# EAGLE design untitled (EAGLE 8.0.1)
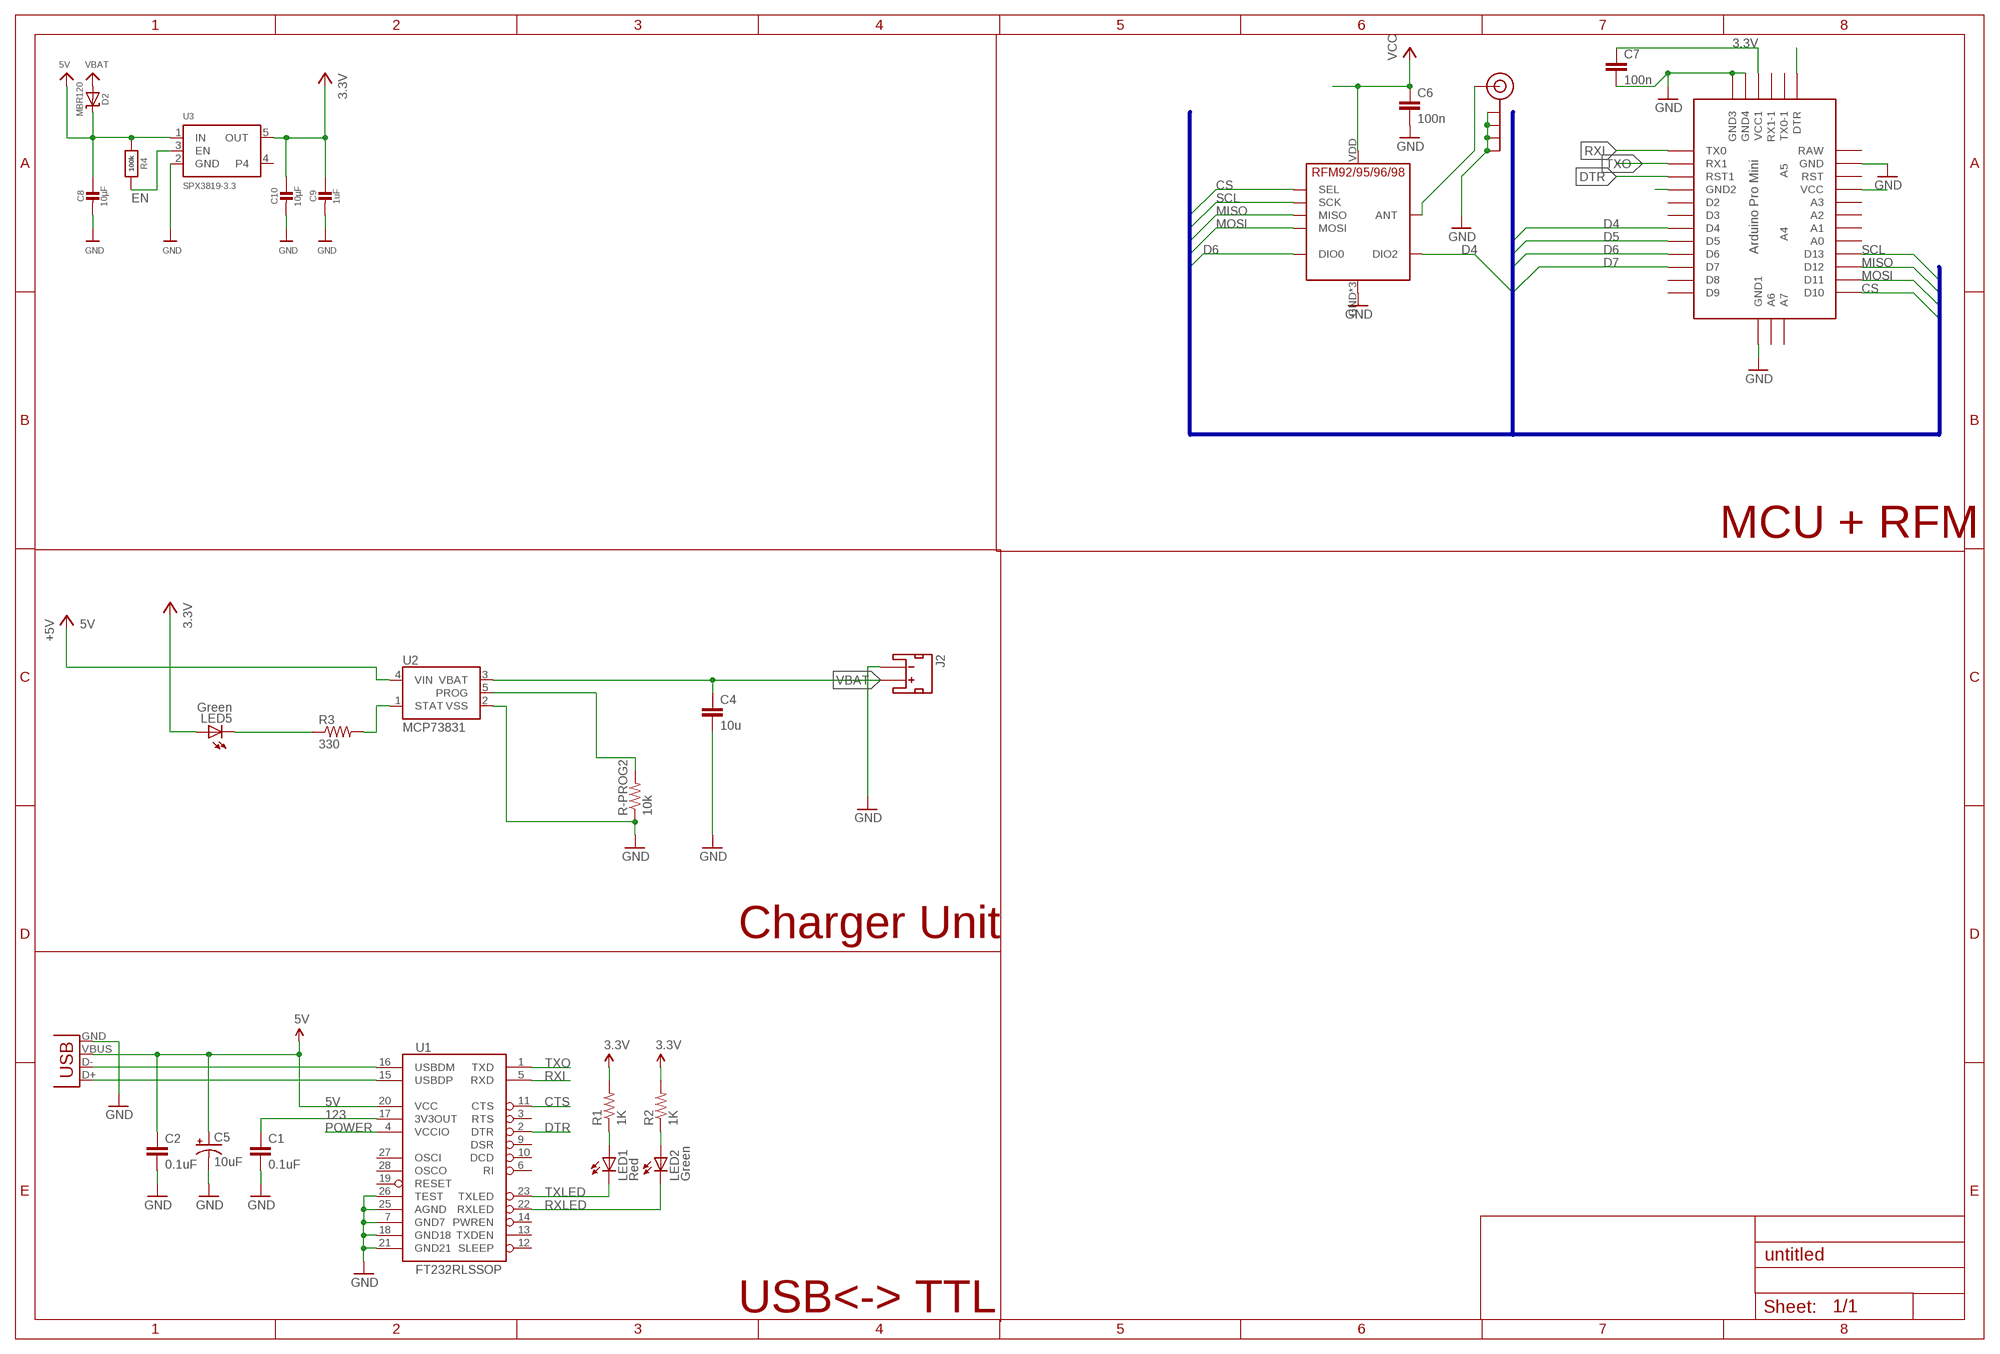
[diagram p0: schematic, sheet 1]

## Parts
C1  0.1uF  CAP0402-CAP  [0402-CAP]
C2  0.1uF  CAP0402-CAP  [0402-CAP]
C4  10u  4.7UF-6.3V-10%(0603)0603  [0603-CAP]
C5  10uF  CAP_POL1206  [EIA3216]
C6  100n  C-EUC0805  [C0805]
C7  100n  C-EUC0805  [C0805]
C8  10µF  CAP_CERAMIC0805-NOOUTLINE  [0805-NO]
C9  1uF  CAP_CERAMIC0603_NO  [0603-NO]
C10  10µF  CAP_CERAMIC0805-NOOUTLINE  [0805-NO]
D2  MBR120  DIODE-SCHOTTKYSOD-123  [SOD-123]
J2  JST_2MM_MALE  [JST-2-SMD]
J$2  ANTENNATINY  [SMA_UFL_PAD_TINY]
LED1  Red  LED0603  [LED-0603]
LED2  Green  LED0603  [LED-0603]
LED5  Green  LED0603  [LED-0603]
R1  1K  RESISTOR0402-RES  [0402-RES]
R2  1K  RESISTOR0402-RES  [0402-RES]
R3  330  330OHM1/10W1%(0603)  [0603-RES]
R4  100k  RESISTOR_0603_NOOUT  [0603-NO]
R-PROG2  10k  10KOHM1/10W1%(0603)0603  [0603-RES]
U1  FT232RLSSOP  [SSOP28DB]
U2  MCP73831  [SOT23-5]
U3  SPX3819-3.3  VREG_SOT23-5  [SOT23-5]
U$1  ABK-PRO-MINI  [ABK-PRO-MINI]
U$6  RFM95  [RFM95]
X2  USB-SMD-NS  [USB-MINIB-NOSTOP]

## Nets
3.3V [power]: C6.1 C7.1 C9.1 C10.1 R1.2 R2.2 U3.5(OUT) U$1.VCC U$1.VCC1 U$6.VDD(VCC) ; supply symbol labelled VCC
5V: C2.1 C5.A(+) C8.1 D2.C R4.1 U1.20(VCC) U2.4(VIN) U3.1(IN) X2.VBUS ; supply symbol labelled +5V
123 [power]: C1.1 U1.17(3V3OUT)
+3V3: LED5.A ; supply symbol labelled 3.3V
CS: U$1.D10 U$6.NSS(SEL)
CTS: U1.11(CTS)
D4: U$1.D4 U$6.DIO2
D5: U$1.D5
D6: U$1.D6 U$6.DIO0
D7: U$1.D7
DTR: U1.2(DTR) U$1.RST1
EN: R4.2 U3.3(EN)
GND: C1.2 C2.2 C4.2 C5.C(-) C6.2 C7.2 C8.2 C9.2 C10.2 J2.1(-) J$2.GND1(GND) J$2.GND2(GND) J$2.GND3(GND) J$2.GND4(GND) R-PROG2.1 U1.7(GND7) U1.18(GND18) U1.21(GND21) U1.25(AGND) U1.26(TEST) U2.2(VSS) U3.2(GND) U$1.GND U$1.GND1(GND2) U$1.GND2(GND3) U$1.GND3(GND4) U$1.GND4(GND1) U$6.GND U$6.GND1(GND) U$6.GND2(GND) X2.GND
LOL: R-PROG2.2 U2.5(PROG)
MISO: U$1.D12 U$6.MISO
MOSI: U$1.D11 U$6.MOSI
N$1: LED1.A R1.1
N$2: LED2.A R2.1
N$4: J$2.ANT1(SIGNAL) J$2.ANT2(SIGNAL) J$2.ANT3(SIGNAL) U$6.ANT
N$5: LED5.C R3.1
N$6: R3.2 U2.1(STAT)
N$9: U$1.DTR
POWER: U1.4(VCCIO)
RXI: U1.5(RXD) U$1.TX0
RXLED: LED2.C U1.22(RXLED)
SCL: U$1.D13 U$6.SCK
TXLED: LED1.C U1.23(TXLED)
TXO: U1.1(TXD) U$1.RX1
USB_D+: U1.15(USBDP) X2.D+
USB_D-: U1.16(USBDM) X2.D-
VBAT: C4.1 D2.A J2.2(+) U2.3(VBAT)
Unconnected: J2.NC1(PAD1) J2.NC2(PAD2) U1.3(RTS) U1.6(RI) U1.9(DSR) U1.10(DCD) U1.12(SLEEP) U1.13(TXDEN) U1.14(PWREN) U1.19(RESET) U1.27(OSCI) U1.28(OSCO) U3.4 U$1.A0 U$1.A1 U$1.A2 U$1.A3 U$1.A4 U$1.A5 U$1.A6 U$1.A7 U$1.D2 U$1.D3 U$1.D8 U$1.D9 U$1.RAW U$1.RST U$1.RX1-1 U$1.TX0-1

## Buses
SCL,MISO,MOSI,CS,D4,D5,D6,D7

## Notes on the sheet
- MCU + RFM
- Charger Unit
- USB<-> TTL

## Library data of the parts
C1 C2 = SparkFun:CAP: Capacitor Standard 0603 ceramic capacitor, and 0.1" leaded capacitor.
C4 = SparkFun-Capacitors:4.7UF-6.3V-10%(0603): CAP-08280; PROD_ID: CAP-08280; VALUE: 4.7uF
C5 = SparkFun:CAP_POL: Capacitor Polarized These are standard SMD and PTH capacitors. Normally 10uF, 47uF, and 100uF in electrolytic and tantalum varieties. Always verify the external diameter of the through hole cap, it varies with capacity, voltage, and manufacturer. The EIA devices should be standard.
C6 C7 = rcl:C-EU: CAPACITOR, European symbol
C8-C10 = microbuilder:CAP_CERAMIC: Ceramic Capacitors For new designs, use the packages preceded by an '_' character since they are more reliable: The following footprints should be used on most boards: _0402 - Standard footprint for regular board layouts _0603 - Standard footprint for regular board layouts _0805 - Standard footprint for regular board layouts _1206 - Standard footprint for regular board layouts For extremely tight-pitch boards where space is at a premium, the following 'micro-pitch' footprints can be used (smaller pads, no silkscreen outline, etc.): _0402MP - Micro-pitch footprint for very dense/compact boards _0603MP - Micro-pitch footprint for very dense/compact boards _0805MP - Micro-pitch footprint for very dense/compact boards _1206MP - Micro-pitch footprint for very dense/compact boards
D2 = microbuilder:DIODE-SCHOTTKY
J2 = SparkFun-Connectors:JST_2MM_MALE: Mates to single-cell LiPo batteries. CONN-08352; PROD_ID: CONN-08352
J$2 = _c2h:ANTENNA: SMA Antenna Connector End launch SMA connector. The paste layer has been removed so that the connector can be hand soldered onto the board after reflow.
LED1 LED2 LED5 = SparkFun:LED: LEDs Standard schematic elements and footprints for 5mm, 3mm, 1206, and 0603 sized LEDs. 5mm - Spark Fun Electronics SKU : COM-00529 (and others)
R1 R2 = SparkFun:RESISTOR: Resistor Basic schematic elements and footprints for 0603, 1206, and PTH resistors.
R3 = SparkFun-Resistors:330OHM1/10W1%(0603): RES-00818; PROD_ID: RES-00818
R4 = microbuilder:RESISTOR: Resistors For new designs, use the packages preceded by an '_' character since they are more reliable: The following footprints should be used on most boards: _0402 - Standard footprint for regular board layouts _0603 - Standard footprint for regular board layouts _0805 - Standard footprint for regular board layouts _1206 - Standard footprint for regular board layouts For extremely tight-pitch boards where space is at a premium, the following 'micro-pitch' footprints can be used (smaller pads, no silkscreen outline, etc.): _0402MP - Micro-pitch footprint for very dense/compact boards _0603MP - Micro-pitch footprint for very dense/compact boards _0805MP - Micro-pitch footprint for very dense/compact boards _1206MP - Micro-pitch footprint for very dense/compact boards
R-PROG2 = SparkFun-Resistors:10KOHM1/10W1%(0603): RES-00824; PROD_ID: RES-00824; VALUE: 10K
U1 = SparkFun:FT232RL: USB UART FT232RL 4th Generation USB UART (USB <-> Serial) Controller. Spark Fun Electronics SKU : COM-00650
U2 = SparkFun-PowerIC:MCP73831: Miniature single cell, fully integrated Li-Ion, Li-polymer charge management controller http://ww1.microchip.com/downloads/en/DeviceDoc/21984a.pdf IC-09995; PROD_ID: IC-09995
U3 = microbuilder:VREG_SOT23-5: SOT23-5 Fixed Voltage Regulators Part Current Out V Out V In V Dropout θJA (°C/W) TJ (°C) Digikey Part No. ADP121 150mA 3.3V 3.4-5.5V 0.09V @ 150mA -- -- ADP121-AUJZ33R7CT-ND ADP121 150mA 3.0V 3.1-5.5V 0.09V @ 150mA -- -- ADP121-AUJZ30R7CT-ND ADP122 300mA 3.3V 3.4-5.5V 0.085V @ 300mA -- -- ADP122AUJZ-3.3-R7CT-ND ADP1712 300mA 3.3V 3.5-5.5V 0.17V @ 300mA -- -- ADP1712AUJZ-3.3-R7TR-ND AP7311 (Low Cost) 150mA 3.3V 3.5-6V 0.15V @ 150mA -- -- AP7311-33WG-7DICT-ND LD39015M18R 150mA 1.8V 1.9V-5.5V 0.08V @ 100mA -- -- 497-6977-1-ND LP2985A-33DBVR 150mA 3.3V 3.3-16V 0.28V @ 150mA 206 150 296-18479-1-ND MCP1824T-3302E/OT 300mA 3.3V 3.5V-6V 0.2V @ 300mA -- -- MCP1824T-3302E/OTCT-ND MIC5205-2.5YM5 TR 150mA 2.5V 2.7-16V 0.165V @ 150mA -- -- 576-1257-2-ND MIC5205-3.0YM5 TR 150mA 3.0V 3.2V-16V 0.165V @ 150mA -- -- 576-1258-2-ND MIC5205-3.3YM5 TR 150mA 3.3V 3.5V-16V 0.165V @ 150mA -- -- 576-1259-2-ND TPS780330220 150mA 3.3V+2.2V 3.6-5.5V 250mV Max -- -- 296-23332-1-ND TDA3663/N1,135 100mA 3.3V 3.5-45V 0.18V @ 50mA -- -- 568-5343-1-ND Max operating temp can be calculated using θJA, TJ (max junction temperature), and power in watts. Set the "Maximum Ambient Temperature" until it reaches TJ ("Max Junction Temperature"), which is the absolute limit for safe use of the regulator: Heat Sink Temperature Calculator <http://www.daycounter.com/Calculators/Heat-Sink-Temperature-Calculator.phtml> For example, With 12V source into a 3.3V LP2985 and a 30mA load, we are dissipating (12V-3.3V) * 0.03A = 0.261W. With a θJA of 206 °C/W, a TJ of 150°C, and 261mW we can safely use the chip without a heat sink up to 75°C (=147.1°C Junction Temperature).
U$1 = Arduino-clone:ABK-PRO-MINI: ABK Pro-Mini Arduino Clone
U$6 = _c2h:RFM95
X2 = SparkFun:USB: USB Connectors USB-B-PTH is fully proven SKU : PRT-00139 USB-miniB is fully proven SKU : PRT-00587 USB-A-PCB is untested. USB-A-H is throughly reviewed, but untested. Spark Fun Electronics SKU : PRT-00437 USB-B-SMT is throughly reviewed, but untested. Needs silkscreen touching up. USB-A-S has not been used/tested USB-MB-H has not been used/tested

## Net classes
0 default: width 0.254 mm, drill 0.6 mm, clearance 0.254 mm
1 power: width 0.406 mm, drill 0.6 mm, clearance 0.254 mm

## Board
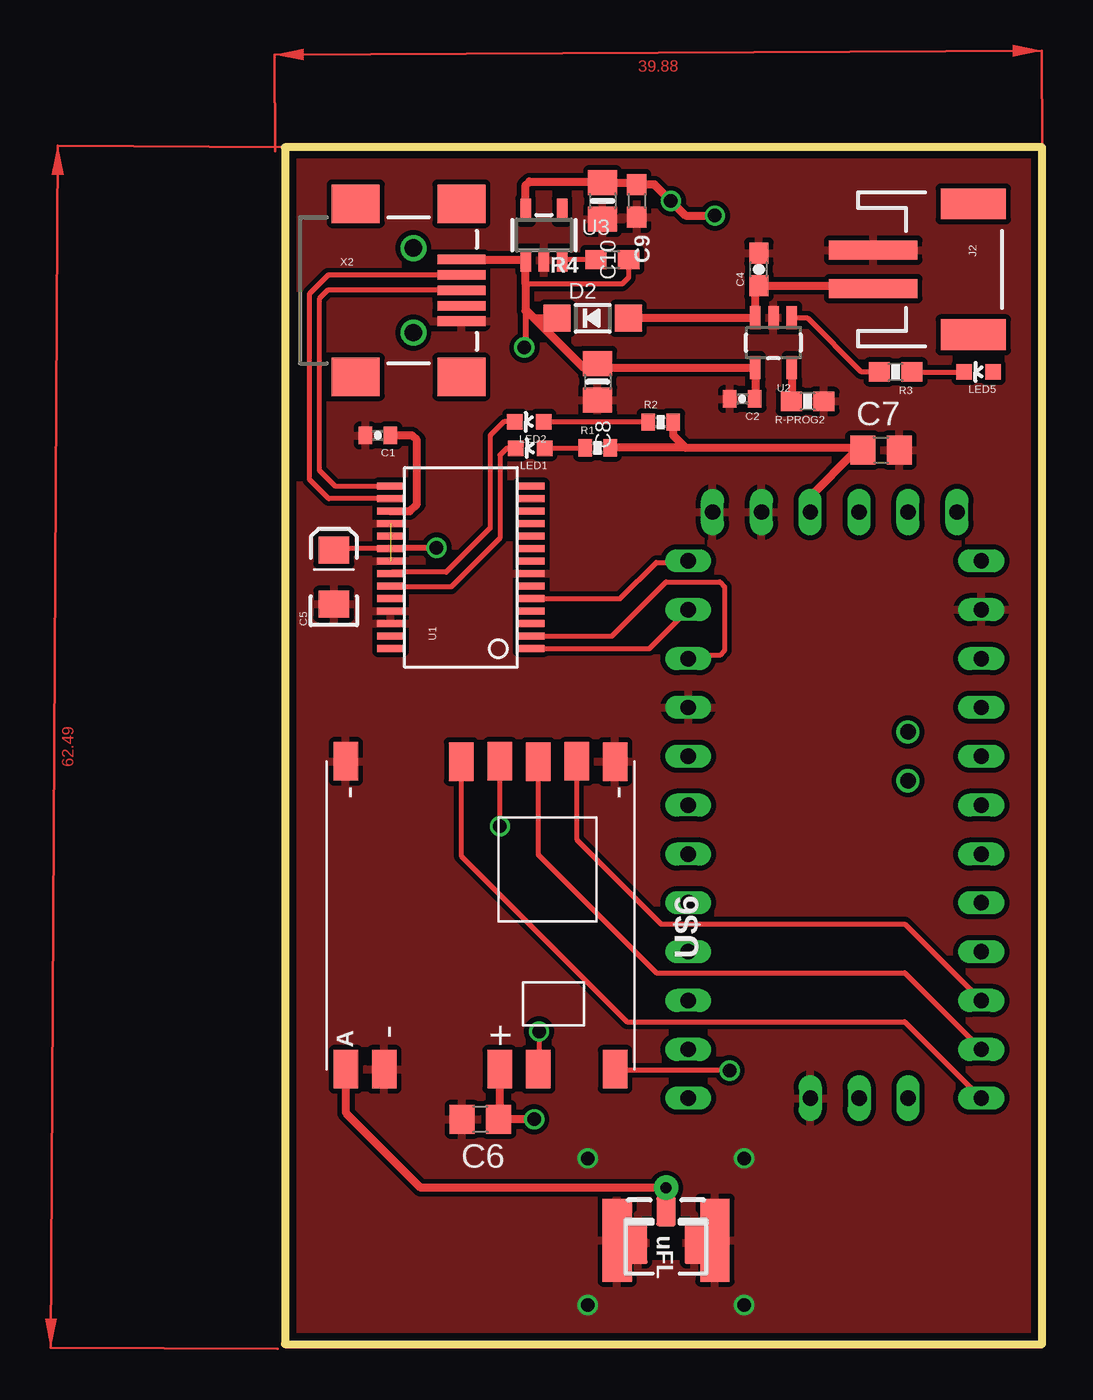
[diagram p1: board, top side]
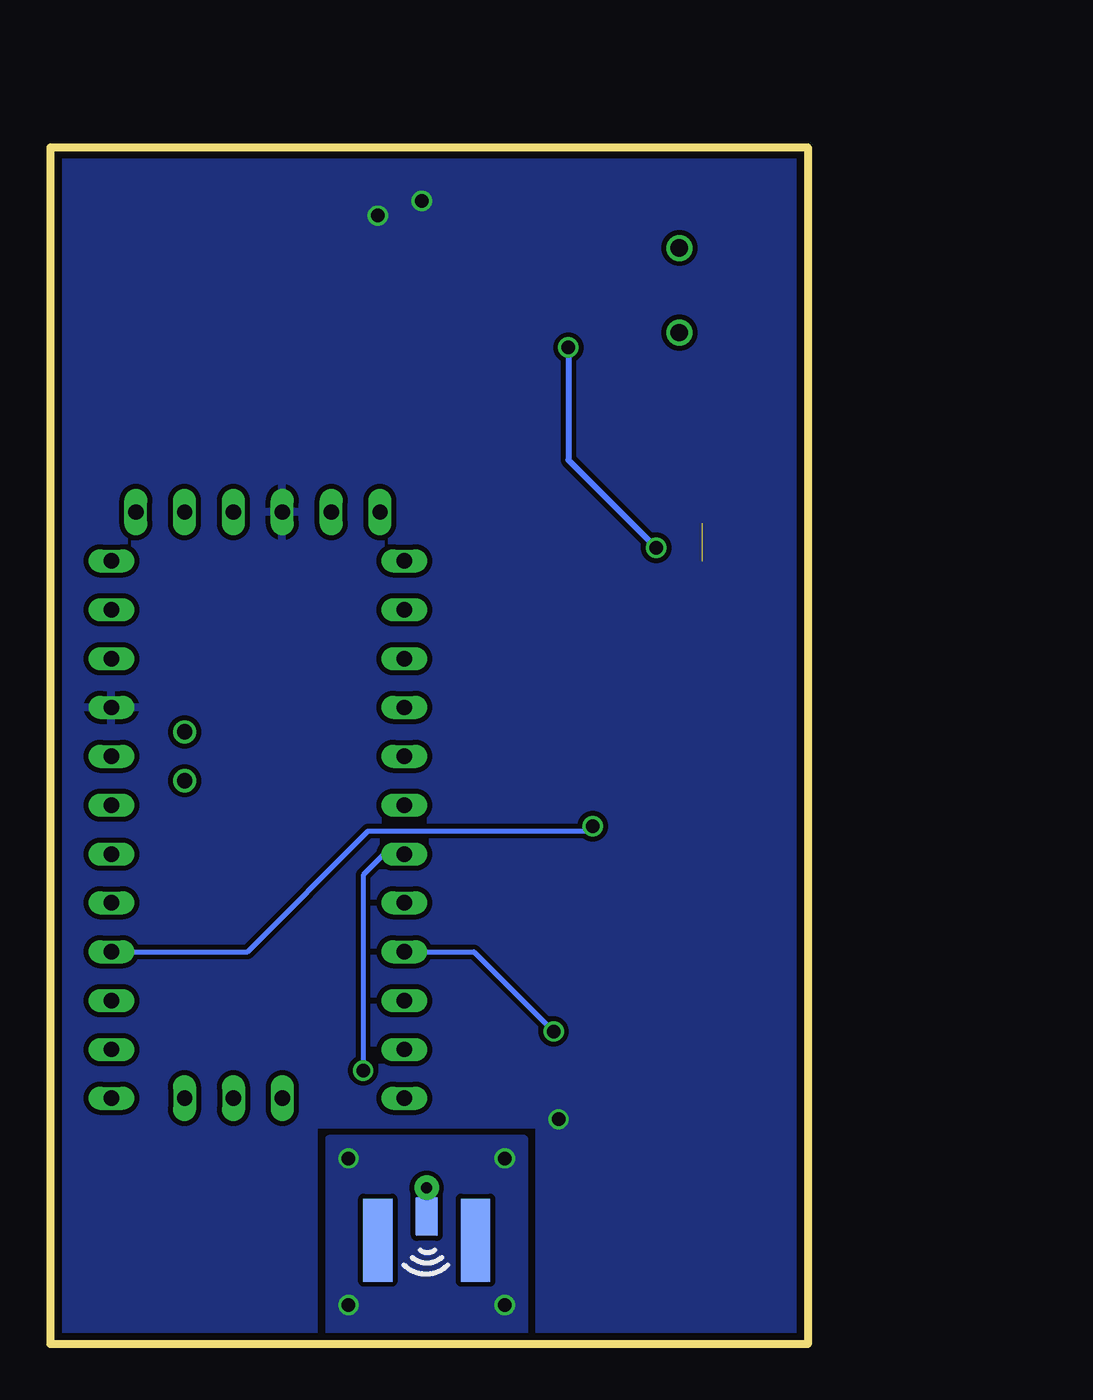
[diagram p2: board, bottom side, seen from below]

Size 39.37 x 62.23 mm. Coordinates in mm from the lower left corner, seen from the top.
Outline: 39.37,62.23 0,62.23 0,0 39.37,0 39.37,62.23
Copper layers (1*16): Top 0.0356mm / dielectric 1.5011mm / Bottom 0.0356mm
Design rules "PCBs_io": minimum track width 6mil, minimum drill 13mil, track to track 6mil, track to pad 6mil, pad to pad 6mil, via to via 6mil, smd to smd 6mil, copper to edge 15mil, drill to drill 6mil, minimum pad ring 7mil, minimum via ring 7mil, stop-mask expansion 3mil, vias tented up to drill 0mil, thermal gap 10mil

### Footprints (pad centres in the part's own frame; a part is rotated, then mirrored left to right if it is on the bottom)
0402-CAP = smd 0.7 x 0.9: 1 -0.65,0; 2 0.65,0
0603-CAP = smd 1.1 x 1: 1 -0.85,0; 2 0.85,0
EIA3216 = smd 1.4 x 1.6: A 1.4,0; C -1.4,0
C0805 = smd 1.3 x 1.5: 1 -0.95,0; 2 0.95,0
0805-NO = smd 1.3 x 1.5: 1 -0.95,0; 2 0.95,0
0603-NO = smd 1.1 x 1: 1 -0.85,0; 2 0.85,0
SOD-123 = smd 1.4 x 1.4: A 1.85,0; C -1.85,0
JST-2-SMD = smd 1 x 4.6: 1 -1,-3.7; 2 1,-3.7 | smd 1.6 x 3.4: NC1 -3.4,1.5; NC2 3.4,1.5
SMA_UFL_PAD_TINY = smd 1.524 x 1.016: ANT1 -3.843,0 | drill 0.559 pad 1.27: ANT2 -5.08,0 | smd 2.032 x 1.143 bottom: ANT3 -3.589,0 | smd 2.2 x 1.016: GND1 -2.223,1.47; GND2 -2.223,-1.47 | smd 4.318 x 1.524: GND3 -2.349,-2.54; GND4 -2.349,2.54 | smd 4.318 x 1.524 bottom: GND5 -2.349,2.54; GND6 -2.349,-2.54
LED-0603 = smd 0.8 x 0.8: A 0,-0.75; C 0,0.75
0402-RES = smd 0.7 x 0.9: 1 -0.65,0; 2 0.65,0
0603-RES = smd 1.1 x 1: 1 -0.85,0; 2 0.85,0
SSOP28DB = smd 0.348 x 1.397: 1 -4.225,-3.656; 2 -3.575,-3.656; 3 -2.925,-3.656; 4 -2.275,-3.656; 5 -1.625,-3.656; 6 -0.975,-3.656; 7 -0.325,-3.656; 8 0.325,-3.656; 9 0.975,-3.656; 10 1.625,-3.656; 11 2.275,-3.656; 12 2.925,-3.656; 13 3.575,-3.656; 14 4.225,-3.656; 15 4.225,3.656; 16 3.575,3.656; 17 2.925,3.656; 18 2.275,3.656; 19 1.625,3.656; 20 0.975,3.656; 21 0.325,3.656; 22 -0.325,3.656; 23 -0.975,3.656; 24 -1.625,3.656; 25 -2.275,3.656; 26 -2.925,3.656; 27 -3.575,3.656; 28 -4.225,3.656
SOT23-5 = smd 0.55 x 1.2: 1 -0.95,-1.3; 2 0,-1.3; 3 0.95,-1.3; 4 0.95,1.3; 5 -0.95,1.3
ABK-PRO-MINI = drill 0.8 long: A0 10.16,-3.81; A1 10.16,-6.35; A2 10.16,-8.89; A3 10.16,-11.43; A6 3.81,-21.59; A7 6.35,-21.59; D2 -5.08,-3.81; D3 -5.08,-6.35; D4 -5.08,-8.89; D5 -5.08,-11.43; D6 -5.08,-13.97; D7 -5.08,-16.51; D8 -5.08,-19.05; D9 -5.08,-21.59; D10 10.16,-21.59; D11 10.16,-19.05; D12 10.16,-16.51; D13 10.16,-13.97; DTR 8.89,8.89; GND 10.16,3.81; GND1 -5.08,-1.27; GND2 -3.81,8.89; GND3 -1.27,8.89; GND4 1.27,-21.59; RAW 10.16,6.35; RST 10.16,1.27; RST1 -5.08,1.27; RX1 -5.08,3.81; RX1-1 3.81,8.89; TX0 -5.08,6.35; TX0-1 6.35,8.89; VCC 10.16,-1.27; VCC1 1.27,8.89 | drill 0.8: A4 6.35,-5.08; A5 6.35,-2.54
RFM95 = smd 2 x 1.27: ANT 5.777,-7; DIO0 5.777,3; DIO2 5.779,7; GND 5.777,-5; GND1 -10.223,7; GND2 -10.23,-7; MISO -10.23,5; MOSI -10.225,3; NSS -10.223,-1; SCK -10.23,1.012; VDD 5.777,1
USB-MINIB-NOSTOP = smd 2.5 x 0.5: D+ 2.5,0; D- 2.5,0.8; GND 2.5,-1.6; ID 2.5,-0.8; VBUS 2.5,1.6 | smd 2.5 x 2: G1 -3,-4.5; G2 -3,4.5; G3 2.5,4.5; G4 2.5,-4.5 | drill 0.9 pad 0.8: H1 0,2.2 | drill 0.9 pad 0.787: H2 0,-2.2

### Placement (x,y rotation side)
C1  4.83,47.24 180 top
C2  23.78,49.14 180 top
C4  24.64,55.88 90 top
C5  2.54,39.88 90 top
C6  10.16,11.68 180 top
C7  30.99,46.48 0 top
C8  16.26,50.04 270 top
C9  18.29,59.44 270 top
C10  16.51,59.44 270 top
D2  16,53.34 0 top
J2  34.29,55.88 270 top
J$2  19.81,3.05 270 top
LED1  12.75,46.58 90 top
LED2  12.7,47.96 90 top
LED5  36.07,50.55 90 top
R1  16.25,46.6 0 top
R2  19.54,47.94 0 top
R3  31.75,50.55 180 top
R4  17.02,56.39 180 top
R-PROG2  27.18,49.02 180 top
U1  9.14,40.39 90 top
U2  25.4,52.07 180 top
U3  13.46,57.66 0 top
U$1  26.05,34.37 0 top
U$6  10.16,20.07 270 top
X2  6.67,54.79 0 top

### Tracks (layer width: path | path; a pad name or v marks a point on that pad's centre or on a via)
3.3V  (via drill 0.7)
  Top 0.254: R2.2 20.19,47.5
  Top 0.406: U3.5 12.51,60.26 12.7,60.45 16.44,60.45 C10.1 18.19,60.39 C9.1 19.22,60.29 v20.07,59.44 20.83,58.67 v22.35,58.67 | U$6.VDD 11.16,11.77 C6.1 v12.95,11.68 | 20.83,46.6 R1.2 | 20.83,46.6 29.92,46.6 C7.1 29.72,46.48 27.18,43.94 27.18,43.4 U$1.VCC1 | 20.83,46.6 20.19,47.24 R2.2
  pour Bottom: 13.97,0 -0.51,0 -0.51,62.03 39.47,61.54 39.6,-0.25 25.65,-0.25 25.65,11.43 13.97,11.43
5V  (via drill 0.7)
  Top 0.254: C8.1 15.97,50.99 15.75,50.77 | R4.1 17.87,55.46 17.53,55.12 12.51,55.12 | U1.20 2.62,41.36 C5.A
  Top 0.305: 12.45,53.72 12.51,53.78 12.51,51.88 v12.45,51.82 | v7.87,41.4 5.53,41.4 U1.20
  Top 0.406: X2.VBUS 12.48,56.39 U3.1 12.51,55.12 12.51,53.78 12.95,53.34 | 12.95,53.34 D2.C | 12.95,53.34 15.52,50.77 15.75,50.77 U2.4 24.45,49.16 C2.1
  Bottom 0.305: v12.45,51.82 12.45,45.97 v7.87,41.4
123
  Top 0.406: U1.17 6.48,43.31 6.86,43.69 6.86,46.99 6.6,47.24 C1.1
CS
  Top 0.254: U$6.NSS 9.16,25.38 17.78,16.76 32.22,16.76 U$1.D10
D4  (via drill 0.7)
  Top 0.254: v23.11,14.22 17.22,14.22 U$6.DIO2
  Bottom 0.254: U$1.D4 22.02,25.48 23.11,24.38 v23.11,14.22
D6  (via drill 0.7)
  Top 0.254: v13.21,16.26 13.21,14.34 U$6.DIO0
  Bottom 0.254: U$1.D6 17.35,20.4 v13.21,16.26
DTR
  Top 0.254: U1.2 17,36.81 19.81,39.62 22.61,39.62 22.86,39.37 22.86,36.07 22.61,35.81 21.14,35.81 U$1.RST1
EN
  Top 0.254: R4.2 14.44,56.39 U3.3
GND  (via drill 0.7)  (1 unrouted)
  Top 0.406: J$2.GND2 17.4,5.27 J$2.GND3 | J$2.GND1 22.23,5.27 J$2.GND4
  other vias: 15.75,9.65 23.88,9.65 23.88,2.03 15.75,2.03
  pour Top: -0.51,62.48 39.45,62.41 39.55,-0.23 -0.38,-0.25
  pour Bottom: 14.73,0 14.73,10.67 24.89,10.67 24.89,0
LOL
  Top 0.406: U2.5 26.35,49.04 R-PROG2.2
MISO
  Top 0.254: U$6.MISO 15.16,26.24 19.56,21.84 32.22,21.84 U$1.D12
MOSI
  Top 0.254: U$6.MOSI 13.16,25.45 19.3,19.3 32.22,19.3 U$1.D11
N$1
  Top 0.254: LED1.A 15.58,46.58 R1.1
N$2
  Top 0.254: LED2.A 18.87,47.95 R2.1
N$4
  Top 0.406: U$6.ANT 3.18,14.27 3.18,12 7.05,8.13 J$2.ANT2 J$2.ANT1
  Bottom 0.406: J$2.ANT2 J$2.ANT3
N$5
  Top 0.254: R3.1 LED5.C
N$6
  Top 0.254: R3.2 29.97,50.55 27.18,53.34 26.38,53.34 U2.1
RXI
  Top 0.254: U1.5 17.43,38.76 19.3,40.64 20.89,40.64 U$1.TX0
RXLED
  Top 0.254: LED2.C 11.38,47.95 10.67,47.24 10.67,42.42 8.38,40.13 5.56,40.13 U1.22
SCL  (via drill 0.7)
  Top 0.254: v11.18,26.92 U$6.SCK
  Bottom 0.254: U$1.D13 29.13,20.4 22.86,26.67 11.43,26.67 v11.18,26.92
TXLED
  Top 0.254: LED1.C 11.53,46.58 11.18,46.23 11.18,41.91 8.64,39.37 5.53,39.37 U1.23
TXO
  Top 0.254: U1.1 18.95,36.16 U$1.RX1
USB_D+
  Top 0.254: X2.D+ 2.21,54.79 1.78,54.36 1.78,45.44 2.59,44.62 5.48,44.62 U1.15
USB_D-
  Top 0.254: X2.D- 2.25,55.59 1.27,54.61 1.27,44.96 2.27,43.96 U1.16
VBAT
  Top 0.406: D2.A 17.88,53.37 U2.3 24.45,54.84 C4.1 30.44,55.03 J2.2
(copper drawn outside any net)
  shapes: Top area x2